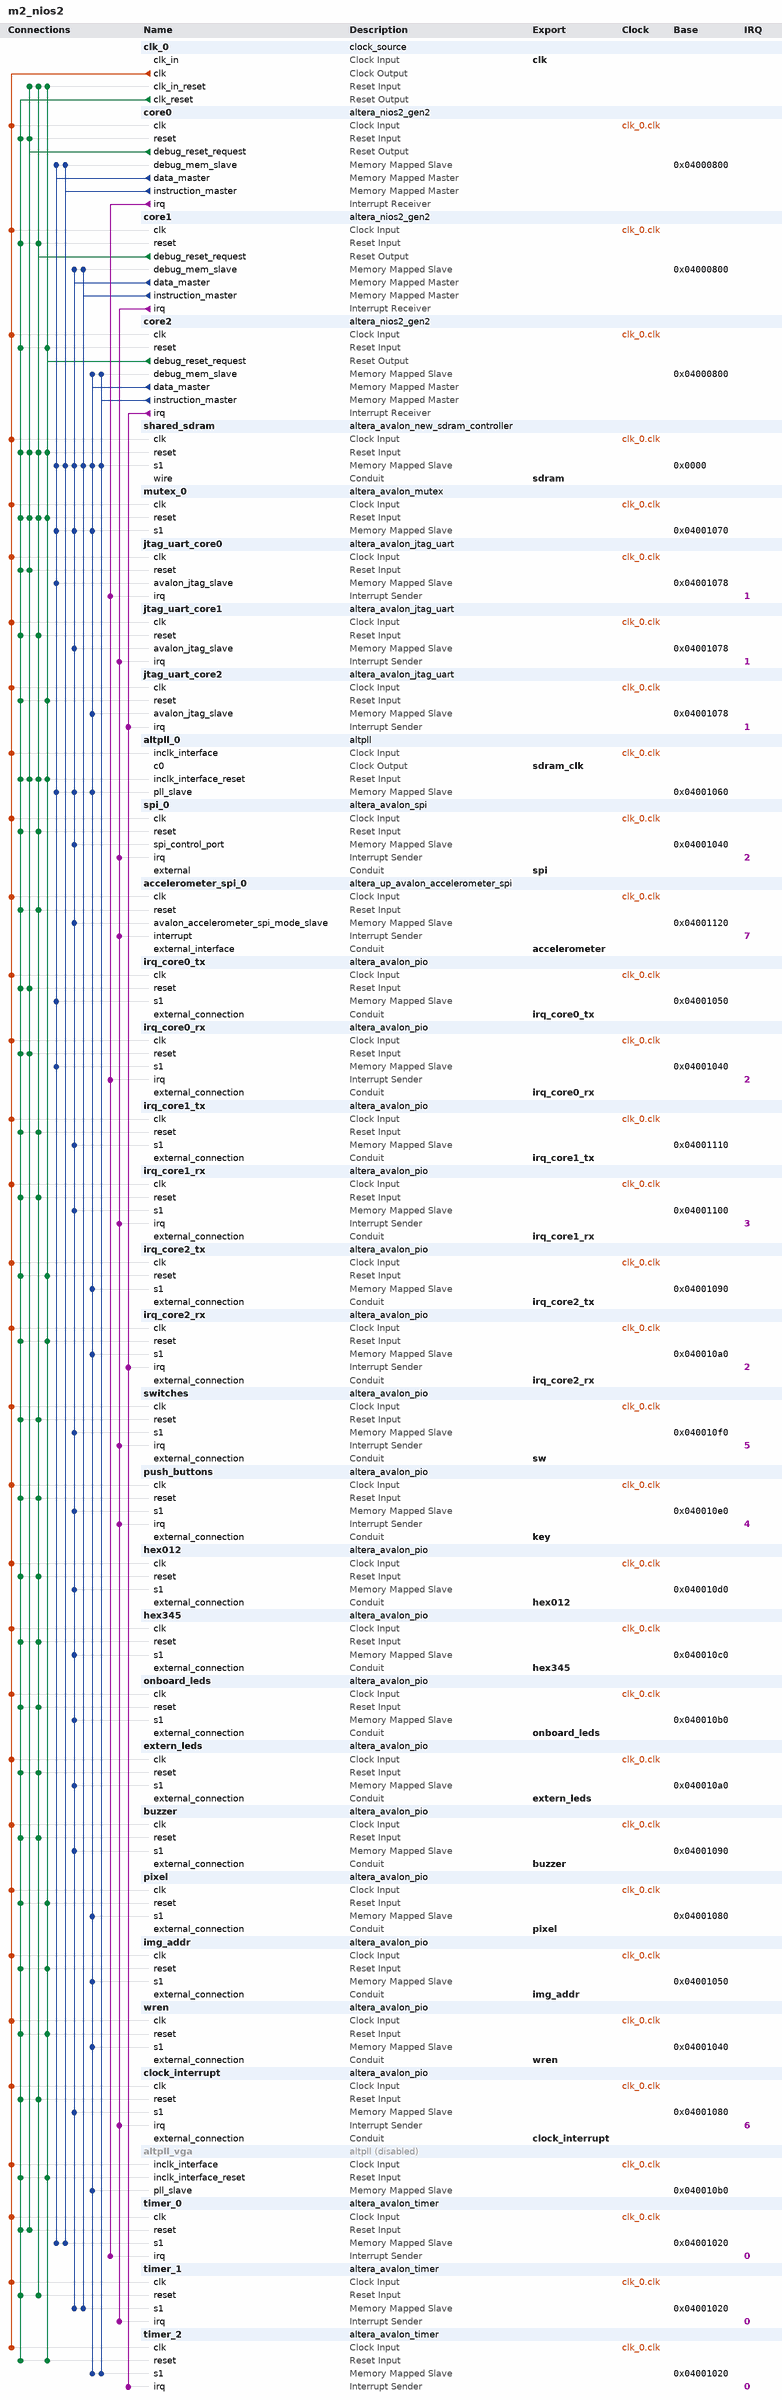
[diagram p0: system contents]
# Platform Designer (Qsys) system m2_nios2, MAX 10 10M50DAF484C7G
# Parameters at their usual value, and those the tool derives, are not listed.
package require -exact qsys 18.1
create_system m2_nios2
set_project_property DEVICE_FAMILY {MAX 10}
set_project_property DEVICE 10M50DAF484C7G

add_instance clk_0 clock_source 18.1
set_instance_parameter_value clk_0 clockFrequency 50000000

add_instance core0 altera_nios2_gen2 18.1
set_instance_parameter_value core0 dcache_size 2048
set_instance_parameter_value core0 exceptionSlave shared_sdram.s1
set_instance_parameter_value core0 icache_size 4096
set_instance_parameter_value core0 impl Fast
set_instance_parameter_value core0 resetSlave shared_sdram.s1

add_instance core1 altera_nios2_gen2 18.1
set_instance_parameter_value core1 cpuID 1
set_instance_parameter_value core1 dcache_size 2048
set_instance_parameter_value core1 exceptionOffset 10485792
set_instance_parameter_value core1 exceptionSlave shared_sdram.s1
set_instance_parameter_value core1 icache_size 4096
set_instance_parameter_value core1 impl Fast
set_instance_parameter_value core1 resetOffset 10485760
set_instance_parameter_value core1 resetSlave shared_sdram.s1

add_instance core2 altera_nios2_gen2 18.1
set_instance_parameter_value core2 cpuID 2
set_instance_parameter_value core2 dcache_size 2048
set_instance_parameter_value core2 exceptionOffset 20971552
set_instance_parameter_value core2 exceptionSlave shared_sdram.s1
set_instance_parameter_value core2 icache_size 4096
set_instance_parameter_value core2 impl Fast
set_instance_parameter_value core2 resetOffset 20971520
set_instance_parameter_value core2 resetSlave shared_sdram.s1

add_instance shared_sdram altera_avalon_new_sdram_controller 18.1
set_instance_parameter_value shared_sdram TAC 5.5
set_instance_parameter_value shared_sdram TRCD 20.0
set_instance_parameter_value shared_sdram TRP 20.0
set_instance_parameter_value shared_sdram casLatency 3
set_instance_parameter_value shared_sdram columnWidth 10
set_instance_parameter_value shared_sdram dataWidth 16
set_instance_parameter_value shared_sdram generateSimulationModel false
set_instance_parameter_value shared_sdram model single_Micron_MT48LC4M32B2_7_chip
set_instance_parameter_value shared_sdram numberOfBanks 4
set_instance_parameter_value shared_sdram numberOfChipSelects 1
set_instance_parameter_value shared_sdram powerUpDelay 100.0
set_instance_parameter_value shared_sdram refreshPeriod 15.625
set_instance_parameter_value shared_sdram rowWidth 13

add_instance mutex_0 altera_avalon_mutex 18.1

add_instance jtag_uart_core0 altera_avalon_jtag_uart 18.1
set_instance_parameter_value jtag_uart_core0 simInteractiveOptions NO_INTERACTIVE_WINDOWS

add_instance jtag_uart_core1 altera_avalon_jtag_uart 18.1
set_instance_parameter_value jtag_uart_core1 simInteractiveOptions NO_INTERACTIVE_WINDOWS

add_instance jtag_uart_core2 altera_avalon_jtag_uart 18.1
set_instance_parameter_value jtag_uart_core2 simInteractiveOptions NO_INTERACTIVE_WINDOWS

add_instance altpll_0 altpll 18.1
set_instance_parameter_value altpll_0 CLK0_DIVIDE_BY 1
set_instance_parameter_value altpll_0 CLK0_MULTIPLY_BY 1
set_instance_parameter_value altpll_0 CLK0_PHASE_SHIFT -3000
set_instance_parameter_value altpll_0 CLK1_DIVIDE_BY 2
set_instance_parameter_value altpll_0 CLK1_DUTY_CYCLE 50
set_instance_parameter_value altpll_0 CLK1_MULTIPLY_BY 1
set_instance_parameter_value altpll_0 CLK1_PHASE_SHIFT 0
set_instance_parameter_value altpll_0 INCLK0_INPUT_FREQUENCY 20000
set_instance_parameter_value altpll_0 PORT_ARESET PORT_UNUSED
set_instance_parameter_value altpll_0 PORT_LOCKED PORT_UNUSED
set_instance_parameter_value altpll_0 PORT_clk1 PORT_UNUSED
set_instance_parameter_value altpll_0 PORT_clk2 PORT_UNUSED
set_instance_parameter_value altpll_0 PORT_clk3 PORT_UNUSED

add_instance spi_0 altera_avalon_spi 18.1
set_instance_parameter_value spi_0 clockPhase 1
set_instance_parameter_value spi_0 clockPolarity 1
set_instance_parameter_value spi_0 dataWidth 32
set_instance_parameter_value spi_0 masterSPI true
set_instance_parameter_value spi_0 numberOfSlaves 2
set_instance_parameter_value spi_0 targetClockRate 9000000

add_instance accelerometer_spi_0 altera_up_avalon_accelerometer_spi 18.0

add_instance irq_core0_tx altera_avalon_pio 18.1
set_instance_parameter_value irq_core0_tx direction Output
set_instance_parameter_value irq_core0_tx width 32

add_instance irq_core0_rx altera_avalon_pio 18.1
set_instance_parameter_value irq_core0_rx captureEdge true
set_instance_parameter_value irq_core0_rx direction Input
set_instance_parameter_value irq_core0_rx generateIRQ true
set_instance_parameter_value irq_core0_rx irqType EDGE
set_instance_parameter_value irq_core0_rx width 32

add_instance irq_core1_tx altera_avalon_pio 18.1
set_instance_parameter_value irq_core1_tx direction Output
set_instance_parameter_value irq_core1_tx width 32

add_instance irq_core1_rx altera_avalon_pio 18.1
set_instance_parameter_value irq_core1_rx captureEdge true
set_instance_parameter_value irq_core1_rx direction Input
set_instance_parameter_value irq_core1_rx generateIRQ true
set_instance_parameter_value irq_core1_rx irqType EDGE
set_instance_parameter_value irq_core1_rx width 32

add_instance irq_core2_tx altera_avalon_pio 18.1
set_instance_parameter_value irq_core2_tx direction Output
set_instance_parameter_value irq_core2_tx width 32

add_instance irq_core2_rx altera_avalon_pio 18.1
set_instance_parameter_value irq_core2_rx captureEdge true
set_instance_parameter_value irq_core2_rx direction Input
set_instance_parameter_value irq_core2_rx generateIRQ true
set_instance_parameter_value irq_core2_rx irqType EDGE
set_instance_parameter_value irq_core2_rx width 32

add_instance switches altera_avalon_pio 18.1
set_instance_parameter_value switches captureEdge true
set_instance_parameter_value switches direction Input
set_instance_parameter_value switches generateIRQ true
set_instance_parameter_value switches irqType EDGE
set_instance_parameter_value switches width 10

add_instance push_buttons altera_avalon_pio 18.1
set_instance_parameter_value push_buttons captureEdge true
set_instance_parameter_value push_buttons direction Input
set_instance_parameter_value push_buttons generateIRQ true
set_instance_parameter_value push_buttons irqType EDGE
set_instance_parameter_value push_buttons width 2

add_instance hex012 altera_avalon_pio 18.1
set_instance_parameter_value hex012 direction Output
set_instance_parameter_value hex012 width 24

add_instance hex345 altera_avalon_pio 18.1
set_instance_parameter_value hex345 direction Output
set_instance_parameter_value hex345 width 24

add_instance onboard_leds altera_avalon_pio 18.1
set_instance_parameter_value onboard_leds direction Output
set_instance_parameter_value onboard_leds width 10

add_instance extern_leds altera_avalon_pio 18.1
set_instance_parameter_value extern_leds direction Output
set_instance_parameter_value extern_leds width 3

add_instance buzzer altera_avalon_pio 18.1
set_instance_parameter_value buzzer direction Output
set_instance_parameter_value buzzer width 1

add_instance pixel altera_avalon_pio 18.1
set_instance_parameter_value pixel direction Output
set_instance_parameter_value pixel width 4

add_instance img_addr altera_avalon_pio 18.1
set_instance_parameter_value img_addr direction Output
set_instance_parameter_value img_addr width 17

add_instance wren altera_avalon_pio 18.1
set_instance_parameter_value wren direction Output
set_instance_parameter_value wren width 1

add_instance clock_interrupt altera_avalon_pio 18.1
set_instance_parameter_value clock_interrupt captureEdge true
set_instance_parameter_value clock_interrupt direction Input
set_instance_parameter_value clock_interrupt generateIRQ true
set_instance_parameter_value clock_interrupt irqType EDGE
set_instance_parameter_value clock_interrupt width 2

add_instance altpll_vga altpll 18.1
set_instance_property altpll_vga ENABLED false
set_instance_parameter_value altpll_vga CLK0_DIVIDE_BY 2
set_instance_parameter_value altpll_vga CLK0_MULTIPLY_BY 1
set_instance_parameter_value altpll_vga INCLK0_INPUT_FREQUENCY 20000
set_instance_parameter_value altpll_vga PORT_ARESET PORT_UNUSED
set_instance_parameter_value altpll_vga PORT_LOCKED PORT_UNUSED
set_instance_parameter_value altpll_vga PORT_clk1 PORT_UNUSED
set_instance_parameter_value altpll_vga PORT_clk2 PORT_UNUSED
set_instance_parameter_value altpll_vga PORT_clk3 PORT_UNUSED

add_instance timer_0 altera_avalon_timer 18.1
set_instance_parameter_value timer_0 period 1
set_instance_parameter_value timer_0 periodUnits MSEC

add_instance timer_1 altera_avalon_timer 18.1
set_instance_parameter_value timer_1 period 1
set_instance_parameter_value timer_1 periodUnits MSEC

add_instance timer_2 altera_avalon_timer 18.1
set_instance_parameter_value timer_2 period 1
set_instance_parameter_value timer_2 periodUnits MSEC

# connections
add_connection clk_0.clk accelerometer_spi_0.clk clock
add_connection clk_0.clk altpll_0.inclk_interface clock
add_connection clk_0.clk altpll_vga.inclk_interface clock
add_connection clk_0.clk buzzer.clk clock
add_connection clk_0.clk clock_interrupt.clk clock
add_connection clk_0.clk core0.clk clock
add_connection clk_0.clk core1.clk clock
add_connection clk_0.clk core2.clk clock
add_connection clk_0.clk extern_leds.clk clock
add_connection clk_0.clk hex012.clk clock
add_connection clk_0.clk hex345.clk clock
add_connection clk_0.clk img_addr.clk clock
add_connection clk_0.clk irq_core0_rx.clk clock
add_connection clk_0.clk irq_core0_tx.clk clock
add_connection clk_0.clk irq_core1_rx.clk clock
add_connection clk_0.clk irq_core1_tx.clk clock
add_connection clk_0.clk irq_core2_rx.clk clock
add_connection clk_0.clk irq_core2_tx.clk clock
add_connection clk_0.clk jtag_uart_core0.clk clock
add_connection clk_0.clk jtag_uart_core1.clk clock
add_connection clk_0.clk jtag_uart_core2.clk clock
add_connection clk_0.clk mutex_0.clk clock
add_connection clk_0.clk onboard_leds.clk clock
add_connection clk_0.clk pixel.clk clock
add_connection clk_0.clk push_buttons.clk clock
add_connection clk_0.clk shared_sdram.clk clock
add_connection clk_0.clk spi_0.clk clock
add_connection clk_0.clk switches.clk clock
add_connection clk_0.clk timer_0.clk clock
add_connection clk_0.clk timer_1.clk clock
add_connection clk_0.clk timer_2.clk clock
add_connection clk_0.clk wren.clk clock
add_connection clk_0.clk_reset accelerometer_spi_0.reset reset
add_connection clk_0.clk_reset altpll_0.inclk_interface_reset reset
add_connection clk_0.clk_reset altpll_vga.inclk_interface_reset reset
add_connection clk_0.clk_reset buzzer.reset reset
add_connection clk_0.clk_reset clock_interrupt.reset reset
add_connection clk_0.clk_reset core0.reset reset
add_connection clk_0.clk_reset core1.reset reset
add_connection clk_0.clk_reset core2.reset reset
add_connection clk_0.clk_reset extern_leds.reset reset
add_connection clk_0.clk_reset hex012.reset reset
add_connection clk_0.clk_reset hex345.reset reset
add_connection clk_0.clk_reset img_addr.reset reset
add_connection clk_0.clk_reset irq_core0_rx.reset reset
add_connection clk_0.clk_reset irq_core0_tx.reset reset
add_connection clk_0.clk_reset irq_core1_rx.reset reset
add_connection clk_0.clk_reset irq_core1_tx.reset reset
add_connection clk_0.clk_reset irq_core2_rx.reset reset
add_connection clk_0.clk_reset irq_core2_tx.reset reset
add_connection clk_0.clk_reset jtag_uart_core0.reset reset
add_connection clk_0.clk_reset jtag_uart_core1.reset reset
add_connection clk_0.clk_reset jtag_uart_core2.reset reset
add_connection clk_0.clk_reset mutex_0.reset reset
add_connection clk_0.clk_reset onboard_leds.reset reset
add_connection clk_0.clk_reset pixel.reset reset
add_connection clk_0.clk_reset push_buttons.reset reset
add_connection clk_0.clk_reset shared_sdram.reset reset
add_connection clk_0.clk_reset spi_0.reset reset
add_connection clk_0.clk_reset switches.reset reset
add_connection clk_0.clk_reset timer_0.reset reset
add_connection clk_0.clk_reset timer_1.reset reset
add_connection clk_0.clk_reset timer_2.reset reset
add_connection clk_0.clk_reset wren.reset reset
add_connection core0.debug_reset_request altpll_0.inclk_interface_reset reset
add_connection core0.debug_reset_request clk_0.clk_in_reset reset
add_connection core0.debug_reset_request core0.reset reset
add_connection core0.debug_reset_request irq_core0_rx.reset reset
add_connection core0.debug_reset_request irq_core0_tx.reset reset
add_connection core0.debug_reset_request jtag_uart_core0.reset reset
add_connection core0.debug_reset_request mutex_0.reset reset
add_connection core0.debug_reset_request shared_sdram.reset reset
add_connection core0.debug_reset_request timer_0.reset reset
add_connection core1.debug_reset_request accelerometer_spi_0.reset reset
add_connection core1.debug_reset_request altpll_0.inclk_interface_reset reset
add_connection core1.debug_reset_request buzzer.reset reset
add_connection core1.debug_reset_request clk_0.clk_in_reset reset
add_connection core1.debug_reset_request clock_interrupt.reset reset
add_connection core1.debug_reset_request core1.reset reset
add_connection core1.debug_reset_request extern_leds.reset reset
add_connection core1.debug_reset_request hex012.reset reset
add_connection core1.debug_reset_request hex345.reset reset
add_connection core1.debug_reset_request irq_core1_rx.reset reset
add_connection core1.debug_reset_request irq_core1_tx.reset reset
add_connection core1.debug_reset_request jtag_uart_core1.reset reset
add_connection core1.debug_reset_request mutex_0.reset reset
add_connection core1.debug_reset_request onboard_leds.reset reset
add_connection core1.debug_reset_request push_buttons.reset reset
add_connection core1.debug_reset_request shared_sdram.reset reset
add_connection core1.debug_reset_request spi_0.reset reset
add_connection core1.debug_reset_request switches.reset reset
add_connection core1.debug_reset_request timer_1.reset reset
add_connection core2.debug_reset_request altpll_0.inclk_interface_reset reset
add_connection core2.debug_reset_request altpll_vga.inclk_interface_reset reset
add_connection core2.debug_reset_request clk_0.clk_in_reset reset
add_connection core2.debug_reset_request core2.reset reset
add_connection core2.debug_reset_request img_addr.reset reset
add_connection core2.debug_reset_request irq_core2_rx.reset reset
add_connection core2.debug_reset_request irq_core2_tx.reset reset
add_connection core2.debug_reset_request jtag_uart_core2.reset reset
add_connection core2.debug_reset_request mutex_0.reset reset
add_connection core2.debug_reset_request pixel.reset reset
add_connection core2.debug_reset_request shared_sdram.reset reset
add_connection core2.debug_reset_request timer_2.reset reset
add_connection core2.debug_reset_request wren.reset reset
add_connection core0.data_master altpll_0.pll_slave avalon
set_connection_parameter_value core0.data_master/altpll_0.pll_slave baseAddress 0x04001060
add_connection core0.data_master core0.debug_mem_slave avalon
set_connection_parameter_value core0.data_master/core0.debug_mem_slave baseAddress 0x04000800
add_connection core0.data_master irq_core0_rx.s1 avalon
set_connection_parameter_value core0.data_master/irq_core0_rx.s1 baseAddress 0x04001040
add_connection core0.data_master irq_core0_tx.s1 avalon
set_connection_parameter_value core0.data_master/irq_core0_tx.s1 baseAddress 0x04001050
add_connection core0.data_master jtag_uart_core0.avalon_jtag_slave avalon
set_connection_parameter_value core0.data_master/jtag_uart_core0.avalon_jtag_slave baseAddress 0x04001078
add_connection core0.data_master mutex_0.s1 avalon
set_connection_parameter_value core0.data_master/mutex_0.s1 baseAddress 0x04001070
add_connection core0.data_master shared_sdram.s1 avalon
set_connection_parameter_value core0.data_master/shared_sdram.s1 baseAddress 0x0000
add_connection core0.data_master timer_0.s1 avalon
set_connection_parameter_value core0.data_master/timer_0.s1 baseAddress 0x04001020
add_connection core0.instruction_master core0.debug_mem_slave avalon
set_connection_parameter_value core0.instruction_master/core0.debug_mem_slave baseAddress 0x04000800
add_connection core0.instruction_master shared_sdram.s1 avalon
set_connection_parameter_value core0.instruction_master/shared_sdram.s1 baseAddress 0x0000
add_connection core0.instruction_master timer_0.s1 avalon
set_connection_parameter_value core0.instruction_master/timer_0.s1 baseAddress 0x04001020
add_connection core1.data_master accelerometer_spi_0.avalon_accelerometer_spi_mode_slave avalon
set_connection_parameter_value core1.data_master/accelerometer_spi_0.avalon_accelerometer_spi_mode_slave baseAddress 0x04001120
add_connection core1.data_master altpll_0.pll_slave avalon
set_connection_parameter_value core1.data_master/altpll_0.pll_slave baseAddress 0x04001060
add_connection core1.data_master buzzer.s1 avalon
set_connection_parameter_value core1.data_master/buzzer.s1 baseAddress 0x04001090
add_connection core1.data_master clock_interrupt.s1 avalon
set_connection_parameter_value core1.data_master/clock_interrupt.s1 baseAddress 0x04001080
add_connection core1.data_master core1.debug_mem_slave avalon
set_connection_parameter_value core1.data_master/core1.debug_mem_slave baseAddress 0x04000800
add_connection core1.data_master extern_leds.s1 avalon
set_connection_parameter_value core1.data_master/extern_leds.s1 baseAddress 0x040010a0
add_connection core1.data_master hex012.s1 avalon
set_connection_parameter_value core1.data_master/hex012.s1 baseAddress 0x040010d0
add_connection core1.data_master hex345.s1 avalon
set_connection_parameter_value core1.data_master/hex345.s1 baseAddress 0x040010c0
add_connection core1.data_master irq_core1_rx.s1 avalon
set_connection_parameter_value core1.data_master/irq_core1_rx.s1 baseAddress 0x04001100
add_connection core1.data_master irq_core1_tx.s1 avalon
set_connection_parameter_value core1.data_master/irq_core1_tx.s1 baseAddress 0x04001110
add_connection core1.data_master jtag_uart_core1.avalon_jtag_slave avalon
set_connection_parameter_value core1.data_master/jtag_uart_core1.avalon_jtag_slave baseAddress 0x04001078
add_connection core1.data_master mutex_0.s1 avalon
set_connection_parameter_value core1.data_master/mutex_0.s1 baseAddress 0x04001070
add_connection core1.data_master onboard_leds.s1 avalon
set_connection_parameter_value core1.data_master/onboard_leds.s1 baseAddress 0x040010b0
add_connection core1.data_master push_buttons.s1 avalon
set_connection_parameter_value core1.data_master/push_buttons.s1 baseAddress 0x040010e0
add_connection core1.data_master shared_sdram.s1 avalon
set_connection_parameter_value core1.data_master/shared_sdram.s1 baseAddress 0x0000
add_connection core1.data_master spi_0.spi_control_port avalon
set_connection_parameter_value core1.data_master/spi_0.spi_control_port baseAddress 0x04001040
add_connection core1.data_master switches.s1 avalon
set_connection_parameter_value core1.data_master/switches.s1 baseAddress 0x040010f0
add_connection core1.data_master timer_1.s1 avalon
set_connection_parameter_value core1.data_master/timer_1.s1 baseAddress 0x04001020
add_connection core1.instruction_master core1.debug_mem_slave avalon
set_connection_parameter_value core1.instruction_master/core1.debug_mem_slave baseAddress 0x04000800
add_connection core1.instruction_master shared_sdram.s1 avalon
set_connection_parameter_value core1.instruction_master/shared_sdram.s1 baseAddress 0x0000
add_connection core1.instruction_master timer_1.s1 avalon
set_connection_parameter_value core1.instruction_master/timer_1.s1 baseAddress 0x04001020
add_connection core2.data_master altpll_0.pll_slave avalon
set_connection_parameter_value core2.data_master/altpll_0.pll_slave baseAddress 0x04001060
add_connection core2.data_master altpll_vga.pll_slave avalon
set_connection_parameter_value core2.data_master/altpll_vga.pll_slave baseAddress 0x040010b0
add_connection core2.data_master core2.debug_mem_slave avalon
set_connection_parameter_value core2.data_master/core2.debug_mem_slave baseAddress 0x04000800
add_connection core2.data_master img_addr.s1 avalon
set_connection_parameter_value core2.data_master/img_addr.s1 baseAddress 0x04001050
add_connection core2.data_master irq_core2_rx.s1 avalon
set_connection_parameter_value core2.data_master/irq_core2_rx.s1 baseAddress 0x040010a0
add_connection core2.data_master irq_core2_tx.s1 avalon
set_connection_parameter_value core2.data_master/irq_core2_tx.s1 baseAddress 0x04001090
add_connection core2.data_master jtag_uart_core2.avalon_jtag_slave avalon
set_connection_parameter_value core2.data_master/jtag_uart_core2.avalon_jtag_slave baseAddress 0x04001078
add_connection core2.data_master mutex_0.s1 avalon
set_connection_parameter_value core2.data_master/mutex_0.s1 baseAddress 0x04001070
add_connection core2.data_master pixel.s1 avalon
set_connection_parameter_value core2.data_master/pixel.s1 baseAddress 0x04001080
add_connection core2.data_master shared_sdram.s1 avalon
set_connection_parameter_value core2.data_master/shared_sdram.s1 baseAddress 0x0000
add_connection core2.data_master timer_2.s1 avalon
set_connection_parameter_value core2.data_master/timer_2.s1 baseAddress 0x04001020
add_connection core2.data_master wren.s1 avalon
set_connection_parameter_value core2.data_master/wren.s1 baseAddress 0x04001040
add_connection core2.instruction_master core2.debug_mem_slave avalon
set_connection_parameter_value core2.instruction_master/core2.debug_mem_slave baseAddress 0x04000800
add_connection core2.instruction_master shared_sdram.s1 avalon
set_connection_parameter_value core2.instruction_master/shared_sdram.s1 baseAddress 0x0000
add_connection core2.instruction_master timer_2.s1 avalon
set_connection_parameter_value core2.instruction_master/timer_2.s1 baseAddress 0x04001020
add_connection core0.irq irq_core0_rx.irq interrupt
set_connection_parameter_value core0.irq/irq_core0_rx.irq irqNumber 2
add_connection core0.irq jtag_uart_core0.irq interrupt
set_connection_parameter_value core0.irq/jtag_uart_core0.irq irqNumber 1
add_connection core0.irq timer_0.irq interrupt
set_connection_parameter_value core0.irq/timer_0.irq irqNumber 0
add_connection core1.irq accelerometer_spi_0.interrupt interrupt
set_connection_parameter_value core1.irq/accelerometer_spi_0.interrupt irqNumber 7
add_connection core1.irq clock_interrupt.irq interrupt
set_connection_parameter_value core1.irq/clock_interrupt.irq irqNumber 6
add_connection core1.irq irq_core1_rx.irq interrupt
set_connection_parameter_value core1.irq/irq_core1_rx.irq irqNumber 3
add_connection core1.irq jtag_uart_core1.irq interrupt
set_connection_parameter_value core1.irq/jtag_uart_core1.irq irqNumber 1
add_connection core1.irq push_buttons.irq interrupt
set_connection_parameter_value core1.irq/push_buttons.irq irqNumber 4
add_connection core1.irq spi_0.irq interrupt
set_connection_parameter_value core1.irq/spi_0.irq irqNumber 2
add_connection core1.irq switches.irq interrupt
set_connection_parameter_value core1.irq/switches.irq irqNumber 5
add_connection core1.irq timer_1.irq interrupt
set_connection_parameter_value core1.irq/timer_1.irq irqNumber 0
add_connection core2.irq irq_core2_rx.irq interrupt
set_connection_parameter_value core2.irq/irq_core2_rx.irq irqNumber 2
add_connection core2.irq jtag_uart_core2.irq interrupt
set_connection_parameter_value core2.irq/jtag_uart_core2.irq irqNumber 1
add_connection core2.irq timer_2.irq interrupt
set_connection_parameter_value core2.irq/timer_2.irq irqNumber 0

# exported interfaces
add_interface accelerometer conduit end
set_interface_property accelerometer EXPORT_OF accelerometer_spi_0.external_interface
add_interface buzzer conduit end
set_interface_property buzzer EXPORT_OF buzzer.external_connection
add_interface clk clock sink
set_interface_property clk EXPORT_OF clk_0.clk_in
add_interface clock_interrupt conduit end
set_interface_property clock_interrupt EXPORT_OF clock_interrupt.external_connection
add_interface extern_leds conduit end
set_interface_property extern_leds EXPORT_OF extern_leds.external_connection
add_interface hex012 conduit end
set_interface_property hex012 EXPORT_OF hex012.external_connection
add_interface hex345 conduit end
set_interface_property hex345 EXPORT_OF hex345.external_connection
add_interface img_addr conduit end
set_interface_property img_addr EXPORT_OF img_addr.external_connection
add_interface irq_core0_rx conduit end
set_interface_property irq_core0_rx EXPORT_OF irq_core0_rx.external_connection
add_interface irq_core0_tx conduit end
set_interface_property irq_core0_tx EXPORT_OF irq_core0_tx.external_connection
add_interface irq_core1_rx conduit end
set_interface_property irq_core1_rx EXPORT_OF irq_core1_rx.external_connection
add_interface irq_core1_tx conduit end
set_interface_property irq_core1_tx EXPORT_OF irq_core1_tx.external_connection
add_interface irq_core2_rx conduit end
set_interface_property irq_core2_rx EXPORT_OF irq_core2_rx.external_connection
add_interface irq_core2_tx conduit end
set_interface_property irq_core2_tx EXPORT_OF irq_core2_tx.external_connection
add_interface key conduit end
set_interface_property key EXPORT_OF push_buttons.external_connection
add_interface onboard_leds conduit end
set_interface_property onboard_leds EXPORT_OF onboard_leds.external_connection
add_interface pixel conduit end
set_interface_property pixel EXPORT_OF pixel.external_connection
add_interface sdram conduit end
set_interface_property sdram EXPORT_OF shared_sdram.wire
add_interface sdram_clk clock source
set_interface_property sdram_clk EXPORT_OF altpll_0.c0
add_interface spi conduit end
set_interface_property spi EXPORT_OF spi_0.external
add_interface sw conduit end
set_interface_property sw EXPORT_OF switches.external_connection
add_interface wren conduit end
set_interface_property wren EXPORT_OF wren.external_connection

set_interconnect_requirement {$system} qsys_mm.clockCrossingAdapter HANDSHAKE
set_interconnect_requirement {$system} qsys_mm.enableEccProtection FALSE
set_interconnect_requirement {$system} qsys_mm.insertDefaultSlave FALSE
set_interconnect_requirement {$system} qsys_mm.maxAdditionalLatency 1

save_system m2_nios2.qsys
